# EAGLE design signal generator schematic - botttom (EAGLE 8.3.1)
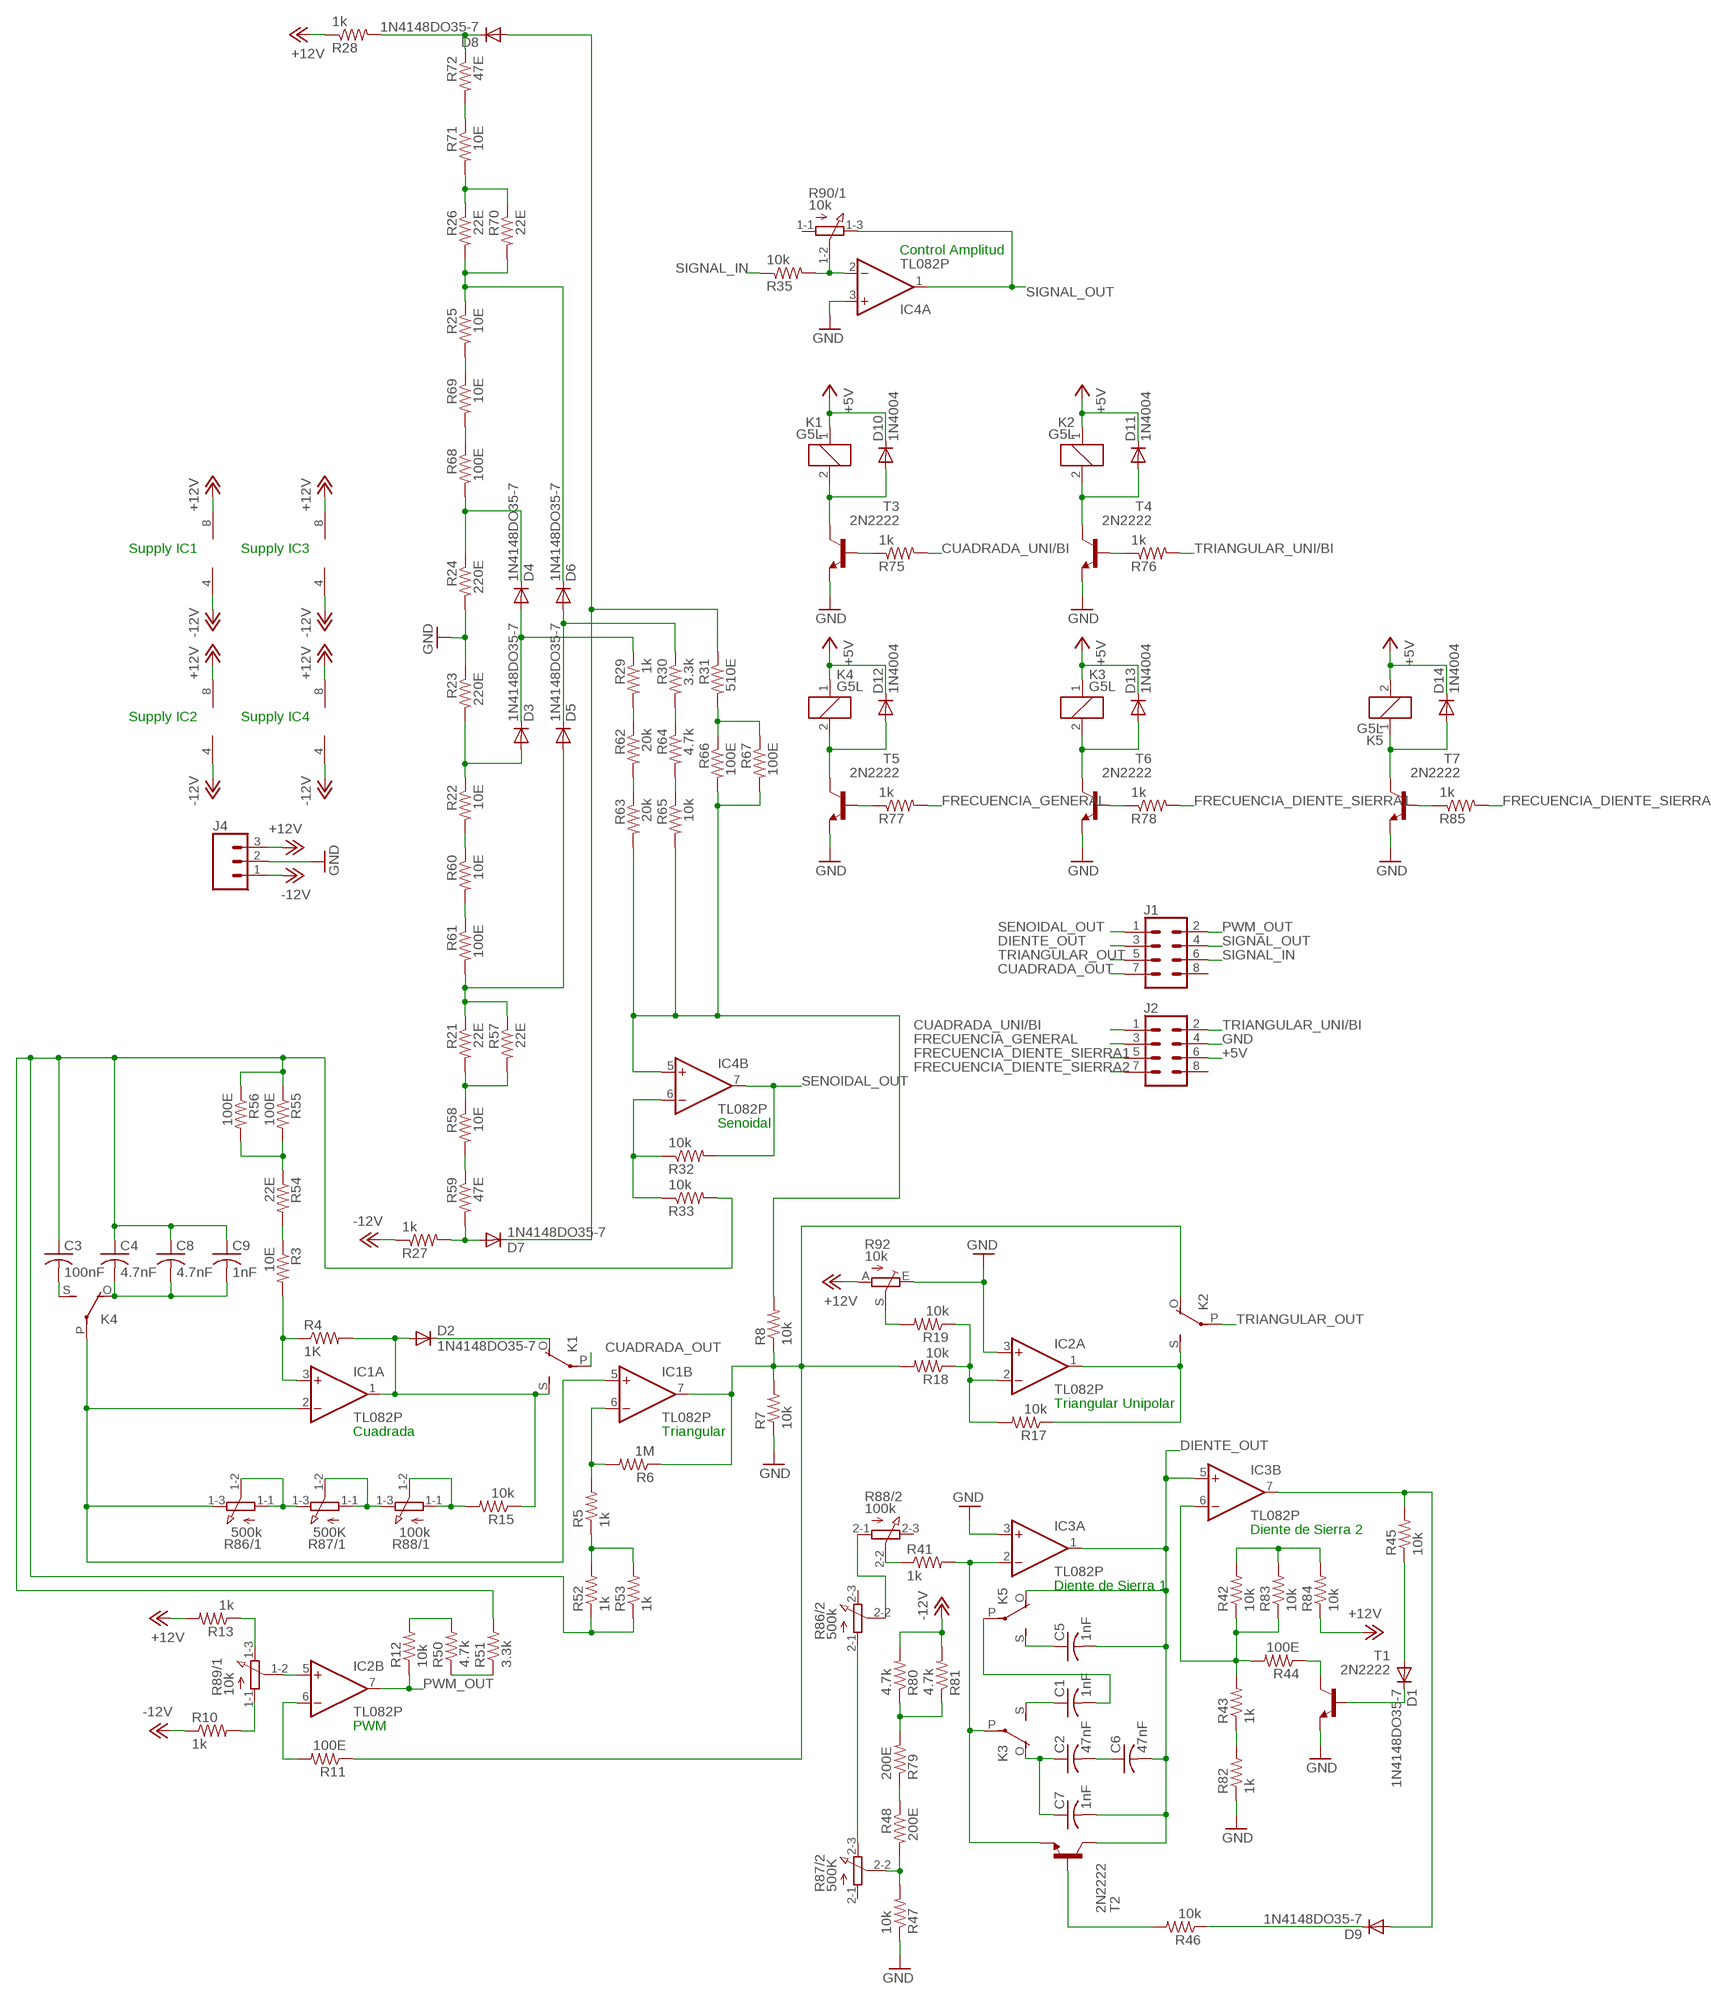
[diagram p0: schematic, sheet 1]

## Parts
C1  1nF  C-US150-054X183  [C150-054X183]
C2  47nF  C-US150-054X183  [C150-054X183]
C3  100nF  C-US150-084X183  [C150-084X183]
C4  4.7nF  C-US102-043X133  [C102-043X133]
C5  1nF  C-US150-054X183  [C150-054X183]
C6  47nF  C-US150-054X183  [C150-054X183]
C7  1nF  C-US150-054X183  [C150-054X183]
C8  4.7nF  C-US102-043X133  [C102-043X133]
C9  1nF  C-US150-054X183  [C150-054X183]
D1  1N4148DO35-7  [DO35-7]
D2  1N4148DO35-7  [DO35-7]
D3  1N4148DO35-7  [DO35-7]
D4  1N4148DO35-7  [DO35-7]
D5  1N4148DO35-7  [DO35-7]
D6  1N4148DO35-7  [DO35-7]
D7  1N4148DO35-7  [DO35-7]
D8  1N4148DO35-7  [DO35-7]
D9  1N4148DO35-7  [DO35-7]
D10  1N4004  [DO41-10]
D11  1N4004  [DO41-10]
D12  1N4004  [DO41-10]
D13  1N4004  [DO41-10]
D14  1N4004  [DO41-10]
IC1  TL082P  [DIL08]
IC2  TL082P  [DIL08]
IC3  TL082P  [DIL08]
IC4  TL082P  [DIL08]
J1  CONN_04X2  [2X4]
J2  CONN_04X2  [2X4]
J4  CONN_03-SCREW-5MM  [SCREWTERMINAL-5MM-3]
K1  G5L  [G5LE]
K2  G5L  [G5LE]
K3  G5L  [G5LE]
K4  G5L  [G5LE]
K5  G5L  [G5LE]
R3  10E  R-US_0207/7  [0207/7]
R4  1K  R-US_0207/7  [0207/7]
R5  1k  R-US_0207/7  [0207/7]
R6  1M  R-US_0207/7  [0207/7]
R7  10k  R-US_0207/7  [0207/7]
R8  10k  R-US_0207/7  [0207/7]
R10  1k  R-US_0207/7  [0207/7]
R11  100E  R-US_0207/7  [0207/7]
R12  10k  R-US_0207/7  [0207/7]
R13  1k  R-US_0207/7  [0207/7]
R15  10k  R-US_0207/7  [0207/7]
R17  10k  R-US_0207/7  [0207/7]
R18  10k  R-US_0207/7  [0207/7]
R19  10k  R-US_0207/7  [0207/7]
R21  22E  R-US_0207/7  [0207/7]
R22  10E  R-US_0207/7  [0207/7]
R23  220E  R-US_0207/7  [0207/7]
R24  220E  R-US_0207/7  [0207/7]
R25  10E  R-US_0207/7  [0207/7]
R26  22E  R-US_0207/7  [0207/7]
R27  1k  R-US_0207/7  [0207/7]
R28  1k  R-US_0207/7  [0207/7]
R29  1k  R-US_0207/7  [0207/7]
R30  3.3k  R-US_0207/7  [0207/7]
R31  510E  R-US_0207/7  [0207/7]
R32  10k  R-US_0207/7  [0207/7]
R33  10k  R-US_0207/7  [0207/7]
R35  10k  R-US_0207/7  [0207/7]
R41  1k  R-US_0207/7  [0207/7]
R42  10k  R-US_0207/7  [0207/7]
R43  1k  R-US_0207/7  [0207/7]
R44  100E  R-US_0207/7  [0207/7]
R45  10k  R-US_0207/7  [0207/7]
R46  10k  R-US_0207/7  [0207/7]
R47  10k  R-US_0207/7  [0207/7]
R48  200E  R-US_0207/7  [0207/7]
R50  4.7k  R-US_0207/7  [0207/7]
R51  3.3k  R-US_0207/7  [0207/7]
R52  1k  R-US_0207/7  [0207/7]
R53  1k  R-US_0207/7  [0207/7]
R54  22E  R-US_0207/7  [0207/7]
R55  100E  R-US_0207/7  [0207/7]
R56  100E  R-US_0207/7  [0207/7]
R57  22E  R-US_0207/7  [0207/7]
R58  10E  R-US_0207/7  [0207/7]
R59  47E  R-US_0207/7  [0207/7]
R60  10E  R-US_0207/7  [0207/7]
R61  100E  R-US_0207/7  [0207/7]
R62  20k  R-US_0207/7  [0207/7]
R63  20k  R-US_0207/7  [0207/7]
R64  4.7k  R-US_0207/7  [0207/7]
R65  10k  R-US_0207/7  [0207/7]
R66  100E  R-US_0207/7  [0207/7]
R67  100E  R-US_0207/7  [0207/7]
R68  100E  R-US_0207/7  [0207/7]
R69  10E  R-US_0207/7  [0207/7]
R70  22E  R-US_0207/7  [0207/7]
R71  10E  R-US_0207/7  [0207/7]
R72  47E  R-US_0207/7  [0207/7]
R75  1k  R-US_0207/7  [0207/7]
R76  1k  R-US_0207/7  [0207/7]
R77  1k  R-US_0207/7  [0207/7]
R78  1k  R-US_0207/7  [0207/7]
R79  200E  R-US_0207/7  [0207/7]
R80  4.7k  R-US_0207/7  [0207/7]
R81  4.7k  R-US_0207/7  [0207/7]
R82  1k  R-US_0207/7  [0207/7]
R83  10k  R-US_0207/7  [0207/7]
R84  10k  R-US_0207/7  [0207/7]
R85  1k  R-US_0207/7  [0207/7]
R86  500k  3RP/1610G  [3RP/1610G]
R87  500K  3RP/1610G  [3RP/1610G]
R88  100k  3RP/1610G  [3RP/1610G]
R89  10k  3RP/1610G  [3RP/1610G]
R90  10k  3RP/1610G  [3RP/1610G]
R92  10k  TRIM_EU-S63P  [S63P]
T1  2N2222  [TO92-EBC-OVAL]
T2  2N2222  [TO92-EBC-OVAL]
T3  2N2222  [TO92-EBC-OVAL]
T4  2N2222  [TO92-EBC-OVAL]
T5  2N2222  [TO92-EBC-OVAL]
T6  2N2222  [TO92-EBC-OVAL]
T7  2N2222  [TO92-EBC-OVAL]

## Nets
+5V: D10.C D11.C D12.C D13.C D14.C J2.6 K1.1 K2.1 K3.1 K4.1 K5.2
+12V: IC1.8(P:V+) IC2.8(P:V+) IC3.8(P:V+) IC4.8(P:V+) J4.3 R13.2 R28.1 R84.1 R92.A
-12V: IC1.4(P:V-) IC2.4(P:V-) IC3.4(P:V-) IC4.4(P:V-) J4.1 R10.1 R27.1 R80.2 R81.2
CUADRADA_OUT: J1.7 K1.P(2:P)
CUADRADA_UNI/BI: J2.1 R75.2
DIENTE_OUT: C5.2 C6.2 C7.2 IC3.1(A:OUT) IC3.5(B:+IN) J1.3 K5.O(2:O) T2.C
FRECUENCIA_DIENTE_SIERRA1: J2.5 R78.2
FRECUENCIA_DIENTE_SIERRA2: J2.7 R85.2
FRECUENCIA_GENERAL: J2.3 R77.2
GND: IC2.3(A:+IN) IC3.3(A:+IN) IC4.3(A:+IN) J2.4 J4.2 R7.1 R23.1 R24.2 R47.1 R82.1 R92.E T1.E T3.E T4.E T5.E T6.E T7.E
N$1: IC1.3(A:+IN) R3.2 R4.1
N$2: C1.2 K5.P(2:P)
N$3: R58.2 R59.1
N$4: R13.1 R89.1-3(/1:E)
N$5: IC1.6(B:-IN) R5.2 R6.2
N$6: R87.1-1(/1:A) R87.1-2(/1:S) R88.1-3(/1:E)
N$7: IC2.5(B:+IN) R89.1-2(/1:S)
N$8: R10.2 R89.1-1(/1:A)
N$9: IC2.6(B:-IN) R11.2
N$10: R19.2 R92.S
N$11: R15.2 R88.1-1(/1:A) R88.1-2(/1:S)
N$12: D5.C D6.A R30.1
N$13: D5.A R21.1 R57.1 R61.2
N$14: IC2.2(A:-IN) R17.2 R18.1 R19.1
N$15: D3.A R22.1 R23.2
N$16: D7.A R27.2 R59.2
N$17: D6.C R25.1 R26.2 R70.2
N$18: IC4.2(A:-IN) R35.2 R90.1-2(/1:S)
N$19: D3.C D4.A R29.1
N$20: D4.C R24.1 R68.2
N$21: D8.C R28.2 R72.1
N$22: D7.C D8.A R31.1
N$23: IC4.5(B:+IN) R8.2 R63.2 R65.2 R66.2 R67.2
N$25: R75.1 T3.B
N$26: IC1.2(A:-IN) IC1.5(B:+IN) K4.P(2:P) R86.1-3(/1:E)
N$27: R41.1 R88.2-2(/2:S)
N$28: C2.1 C7.1 K3.O(2:O)
N$29: IC4.6(B:-IN) R32.1 R33.1
N$30: C1.1 K3.S(2:S)
N$31: R47.2 R48.2 R87.2-2(/2:S)
N$32: R86.2-1(/2:A) R87.2-3(/2:E)
N$33: R46.2 T2.B
N$34: D1.C T1.B
N$35: IC3.6(B:-IN) R42.1 R43.2 R44.2 R83.1
N$36: R44.1 T1.C
N$37: D1.A R45.1
N$38: D9.A IC3.7(B:OUT) R45.2
N$39: D9.C R46.1
N$40: R12.2 R50.2
N$41: R50.1 R51.1
N$42: R5.1 R52.2 R53.2
N$43: C4.2 C8.2 C9.2 K4.O(2:O)
N$44: R3.1 R54.2
N$45: C3.2 K4.S(2:S)
N$46: R54.1 R55.2 R56.2
N$47: R21.2 R57.2 R58.1
N$48: C3.1 C4.1 C8.1 C9.1 R33.2 R51.2 R52.1 R53.1 R55.1 R56.1
N$49: R60.2 R61.1
N$50: R22.2 R60.1
N$51: R29.2 R62.1
N$52: R62.2 R63.1
N$53: R64.2 R65.1
N$54: R30.2 R64.1
N$55: R25.2 R69.1
N$56: R31.2 R66.1 R67.1
N$57: R68.1 R69.2
N$58: R71.1 R72.2
N$59: R26.1 R70.1 R71.2
N$60: D2.C K1.O(2:O)
N$61: D10.A K1.2 T3.C
N$62: R76.1 T4.B
N$63: D11.A K2.2 T4.C
N$64: R77.1 T5.B
N$65: D12.A K4.2 T5.C
N$66: R78.1 T6.B
N$67: D13.A K3.2 T6.C
N$68: IC3.2(A:-IN) K3.P(2:P) R41.2 T2.E
N$69: R48.1 R79.1
N$70: C5.1 K5.S(2:S)
N$71: R79.2 R80.1 R81.1
N$72: R43.1 R82.2
N$73: C2.2 C6.1
N$74: R42.2 R83.2 R84.2
N$75: R86.1-1(/1:A) R86.1-2(/1:S) R87.1-3(/1:E)
N$76: R85.1 T7.B
N$77: D14.A K5.1 T7.C
N$78: R86.2-2(/2:S) R88.2-1(/2:A)
N$90: D2.A IC1.1(A:OUT) K1.S(2:S) R4.2 R15.1
N$91: IC1.7(B:OUT) K2.O(2:O) R6.1 R7.2 R8.1 R11.1 R18.2
N$92: IC2.1(A:OUT) K2.S(2:S) R17.1
PWM_OUT: IC2.7(B:OUT) J1.2 R12.1
SENOIDAL_OUT: IC4.7(B:OUT) J1.1 R32.2
SIGNAL_IN: J1.6 R35.1
SIGNAL_OUT: IC4.1(A:OUT) J1.4 R90.1-3(/1:E)
TRIANGULAR_OUT: J1.5 K2.P(2:P)
TRIANGULAR_UNI/BI: J2.2 R76.2
Unconnected: J1.8 J2.8 R86.2-3(/2:E) R87.2-1(/2:A) R88.2-3(/2:E) R89.2-1(/2:A) R89.2-2(/2:S) R89.2-3(/2:E) R90.1-1(/1:A) R90.2-1(/2:A) R90.2-2(/2:S) R90.2-3(/2:E)

## Notes on the sheet
- Control Amplitud
- Supply IC1 | Supply IC3
- Supply IC2 | Supply IC4
- Senoidal
- Triangular Unipolar
- Cuadrada | Triangular
- Diente de Sierra 2
- Diente de Sierra 1
- PWM

## Library data of the parts
C1-C9 = adafruit:C-US: CAPACITOR, American symbol
D1-D9 = diode:1N4148: DIODE high speed (Philips)
D10-D14 = diode:1N4004: DIODE general purpose rectifier, 1 A
IC1-IC4 = linear:TL082: OP AMP Data sheet <http://www.ti.com/lit/ds/symlink/tl084a . pdf>; DATA_SHEET: <a href="http://www.ti.com/lit/ds/symlink/tl084a.pdf"> Data sheet </a>
J1 J2 = SparkFun-Connectors:CONN_04X2: Multi connection point. Often used as Generic Header-pin footprint for 0.1 inch spaced/style header connections On any of the 0.1 inch spaced packages, you can populate with these: Break Away Headers - Straight <https://www.sparkfun.com/products/116> (PRT-00116) Break Away Male Headers - Right Angle <https://www.sparkfun.com/products/553> (PRT-00553) Female Headers <https://www.sparkfun.com/products/115> (PRT-00115) Break Away Headers - Machine Pin <https://www.sparkfun.com/products/117> (PRT-00117) Break Away Female Headers - Swiss Machine Pin <https://www.sparkfun.com/products/743> (PRT-00743)
J4 = SparkFun-Connectors:CONN_03: Multi connection point. Often used as Generic Header-pin footprint for 0.1 inch spaced/style header connections On any of the 0.1 inch spaced packages, you can populate with these: Break Away Headers - Straight <https://www.sparkfun.com/products/116> (PRT-00116) Break Away Male Headers - Right Angle <https://www.sparkfun.com/products/553> (PRT-00553) Female Headers <https://www.sparkfun.com/products/115> (PRT-00115) Break Away Headers - Machine Pin <https://www.sparkfun.com/products/117> (PRT-00117) Break Away Female Headers - Swiss Machine Pin <https://www.sparkfun.com/products/743> (PRT-00743) Stackable Header - 3 Pin (Female, 0.1") <https://www.sparkfun.com/products/13875> (PRT-13875) For SCREWTERMINALS and SPRING TERMINALS visit here: Screw Terimnals on SparkFun.com <https://www.sparkfun.com/search/results?term=Screw+Terminals> (5mm/3.5mm/2.54mm spacing) This device is also useful as a general connection point to wire up your design to another part of your project. Our various solder wires solder well into these plated through hole pads. Hook-Up Wire - Assortment (Stranded, 22 AWG) <https://www.sparkfun.com/products/11375> (PRT-11375) Hook-Up Wire - Assortment (Solid Core, 22 AWG) <https://www.sparkfun.com/products/11367> (PRT-11367) View the entire wire category on our website here <https://www.sparkfun.com/categories/141> Special notes: Molex polarized connector foot print use with SKU : PRT-08232 with associated crimp pins and housings.; PROD_ID: CONN-10134; SF_SKU: PRT-08433
K1-K5 = relay:G5L: RELAY 1 x switch, 10 A/120 V AC, 8 A/30 V ADC, Omron; OC_FARNELL: unknown; OC_NEWARK: unknown
R3-R8 R10-R13 R15 R17-R19 R21-R33 R35 R41-R48 R50-R72 R75-R85 = adafruit:R-US_: RESISTOR, American symbol
R86-R90 = pot:3RP/1610G: 16mm Potentiometer two level Source: http://www.alphapotentiometers.net/html/16mm_pot_2.html
R92 = pot:TRIM_EU-: POTENTIOMETER
T1-T7 = adafruit:2N2222: NPN TRANSISTOR Big oval pads

## Board
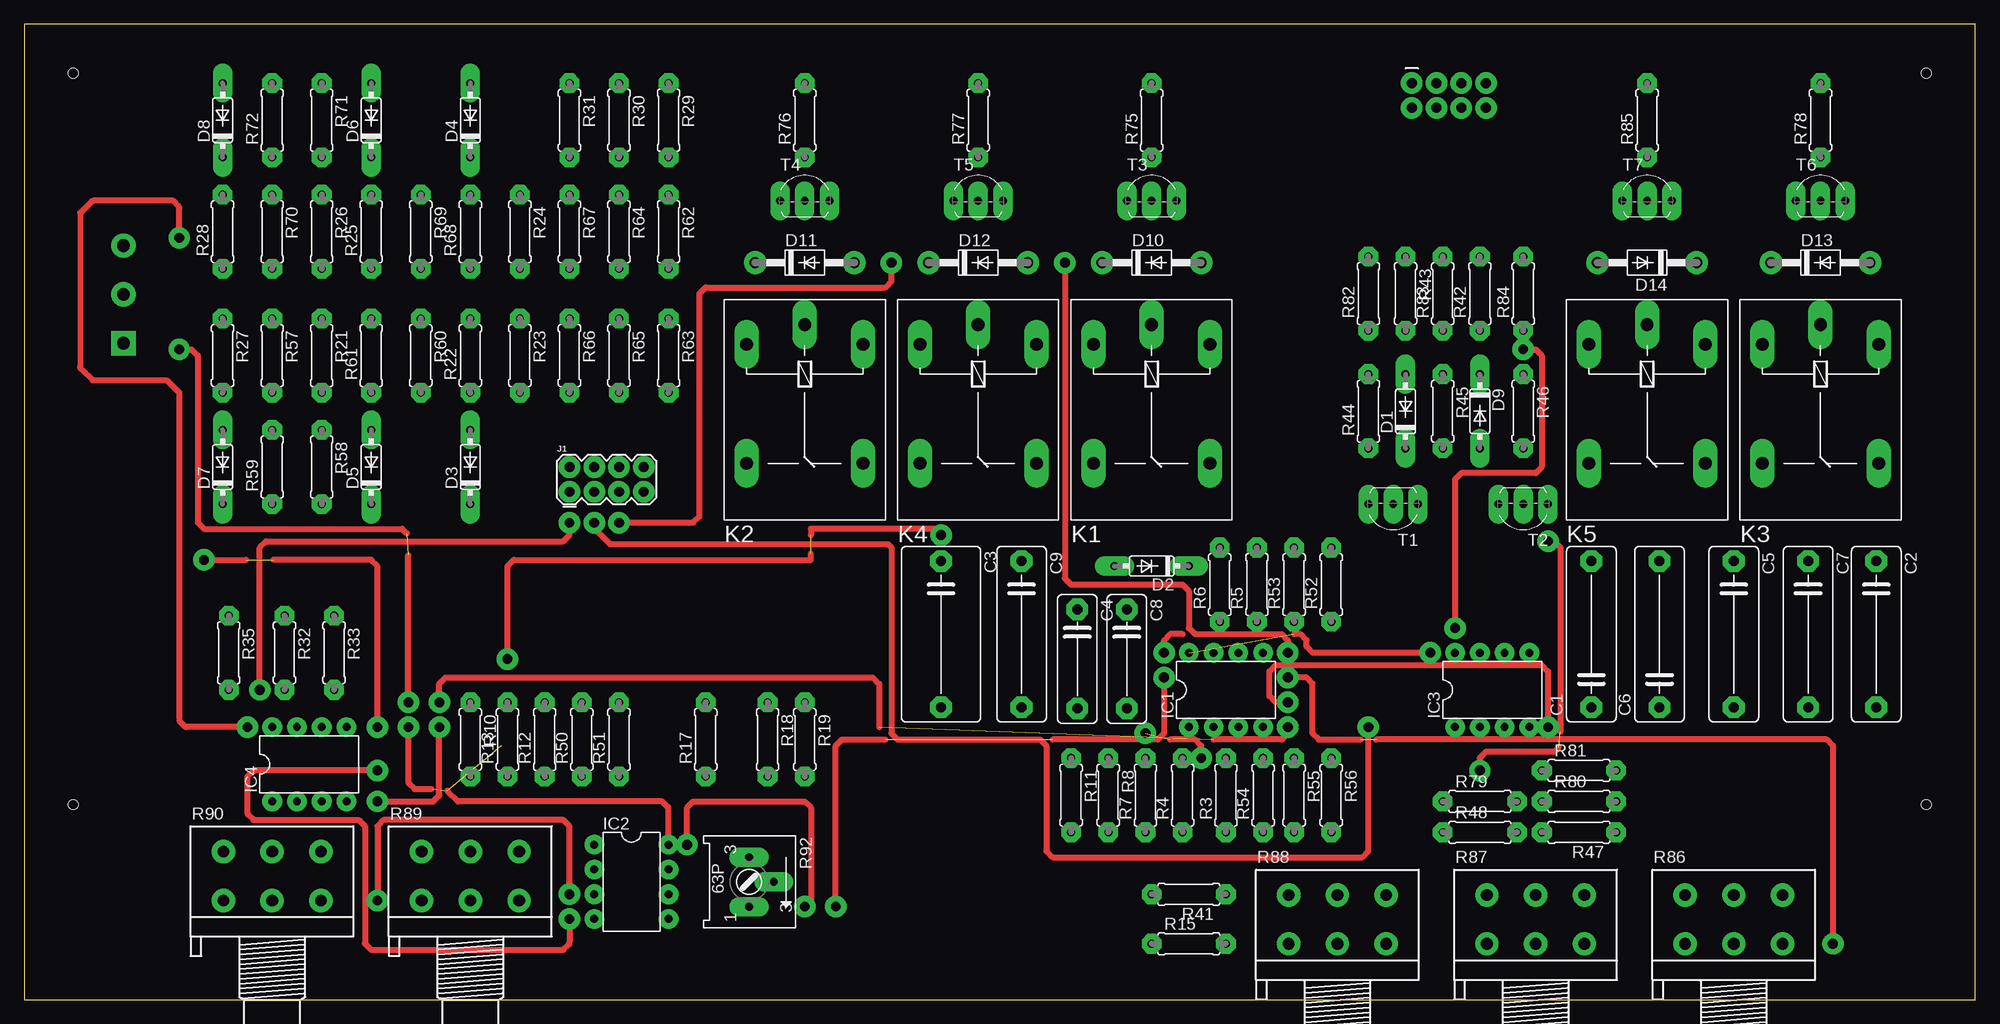
[diagram p1: board, top side]
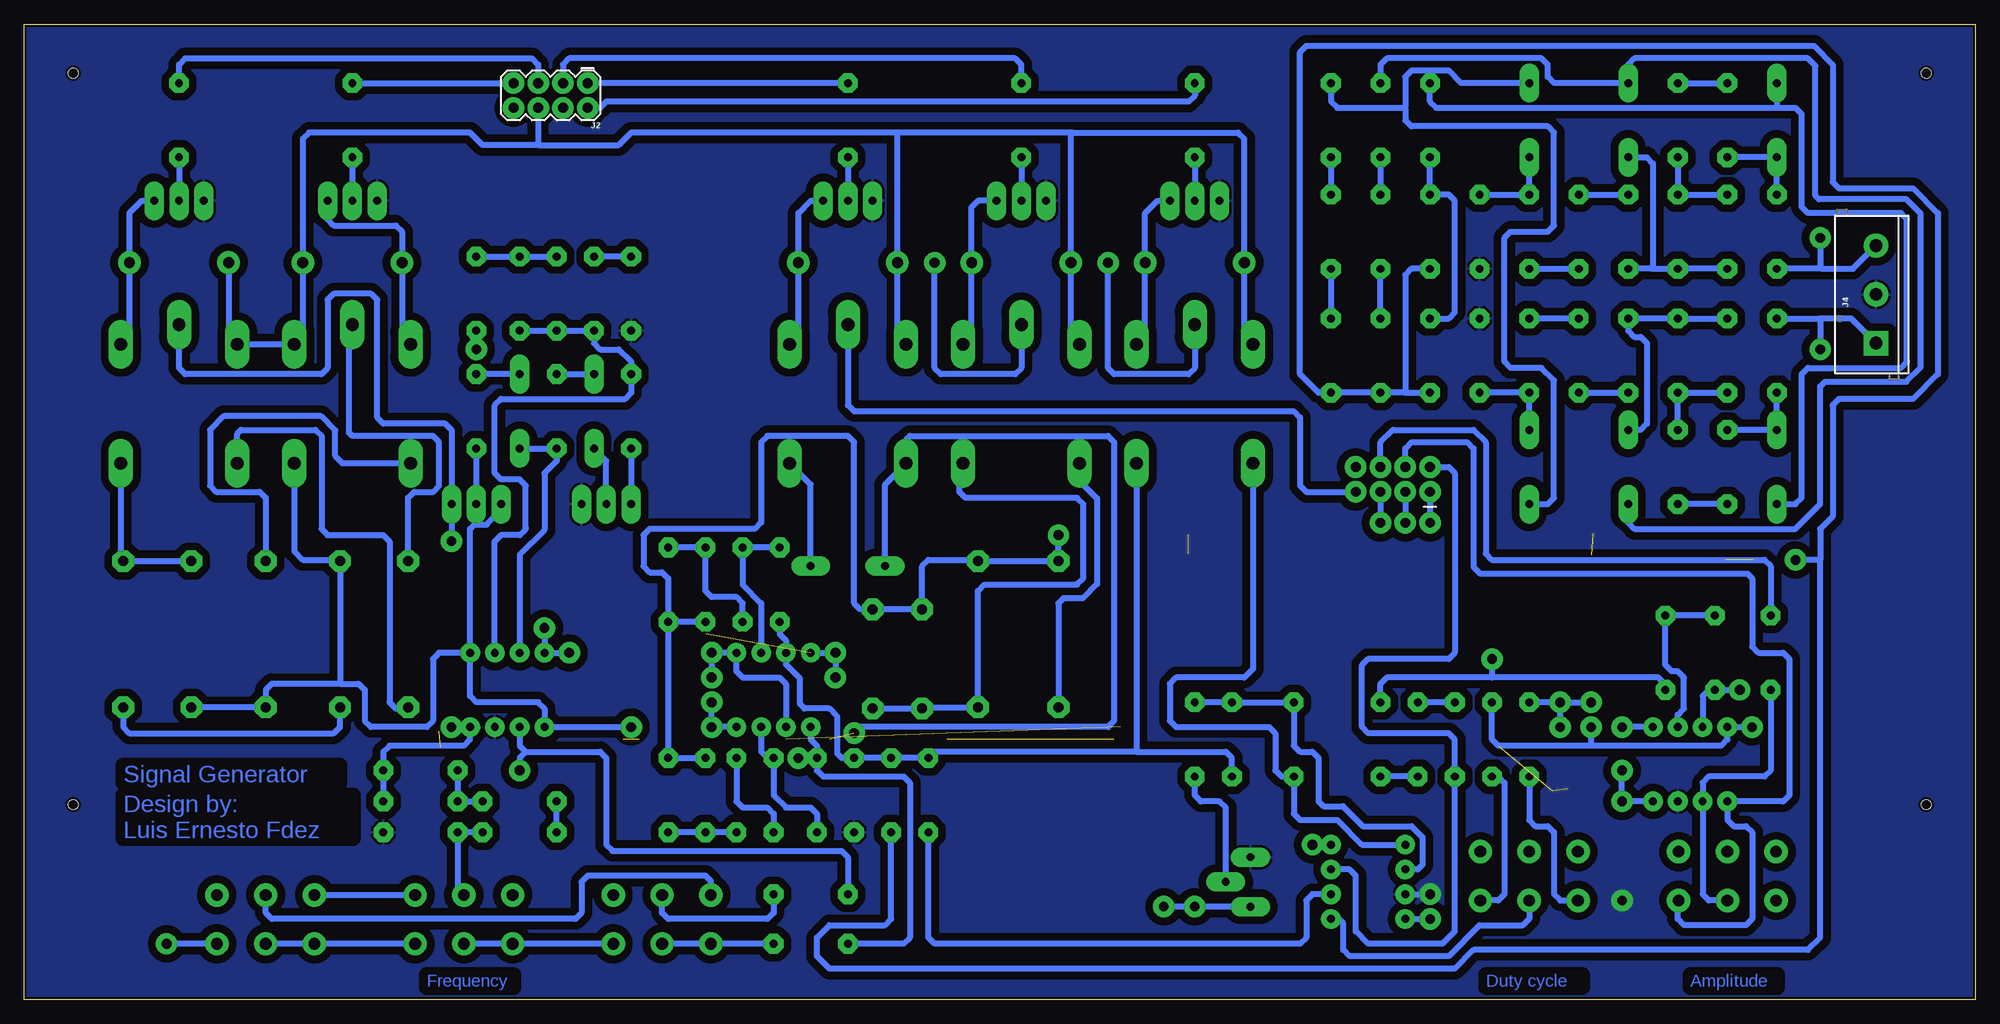
[diagram p2: board, bottom side, seen from below]

Size 200 x 100 mm. Coordinates in mm from the lower left corner, seen from the top.
Outline: 0,0 200,0 200,100 0,100 0,0
Copper layers (1*16): Top 0.035mm / dielectric 1.5mm / Bottom 0.035mm
Design rules "Maker Friendly Design Rules": minimum track width 0.8mm, minimum drill 0.8mm, track to track 0.8mm, track to pad 0.8mm, pad to pad 0.45mm, via to via 0.8mm, smd to smd 8mil, copper to edge 10mil, drill to drill 8mil, minimum pad ring 0.6mm, minimum via ring 0.6mm, stop-mask expansion 0mil, vias tented up to drill 0mil, thermal gap 10mil
Holes 1 mm at 5,20 195,20 195,95 5,95

### Footprints (pad centres in the part's own frame; a part is rotated, then mirrored left to right if it is on the bottom)
C150-054X183 = drill 1.016 octagon: 1 -7.493,0; 2 7.493,0
C150-084X183 = drill 1.016 octagon: 1 -7.493,0; 2 7.493,0
C102-043X133 = drill 1.016 octagon: 1 -5.08,0; 2 5.08,0
DO35-7 = drill 0.813 long: A 3.81,0; C -3.81,0
DO41-10 = drill 1.118: A 5.08,0; C -5.08,0
DIL08 = drill 0.813 pad 1.27: 1 -3.81,-3.81; 2 -1.27,-3.81; 3 1.27,-3.81; 4 3.81,-3.81; 5 3.81,3.81; 6 1.27,3.81; 7 -1.27,3.81; 8 -3.81,3.81
2X4 = drill 1.016 pad 1.88: 1 -3.81,-1.27; 2 -3.81,1.27; 3 -1.27,-1.27; 4 -1.27,1.27; 5 1.27,-1.27; 6 1.27,1.27; 7 3.81,-1.27; 8 3.81,1.27
SCREWTERMINAL-5MM-3 = drill 1.3 pad 2.413 square: 1 0,0 | drill 1.3 pad 2.413: 2 5,0; 3 10,0
G5LE = drill 1.321 long: 1 -7.493,-5.969; 2 -7.493,5.969; O 4.699,5.969; P -9.525,0; S 4.699,-5.969
0207/7 = drill 0.813 octagon: 1 -3.81,0; 2 3.81,0
3RP/1610G = drill 1.2 pad 2.184: 1-1 -5,0; 1-2 0,0; 1-3 5,0; 2-1 -5,5; 2-2 0,5; 2-3 5,5
S63P = drill 0.813 long: A 2.54,0; E -2.54,0; S 0,2.54
TO92-EBC-OVAL = drill 0.813 long: B 0,-1.27; C 2.54,-1.27; E -2.54,-1.27

### Placement (x,y rotation side)
C1  160.66,37.47 90 top
C2  189.87,37.47 270 top
C3  93.98,37.47 270 top
C4  107.95,34.92 270 top
C5  175.26,37.47 270 top
C6  167.64,37.47 90 top
C7  182.88,37.47 270 top
C8  113.03,34.92 270 top
C9  102.23,37.47 270 top
D1  141.6,60.33 90 top
D2  115.57,44.45 180 top
D3  45.72,54.61 90 top
D4  45.72,90.17 90 top
D5  35.56,54.61 90 top
D6  35.56,90.17 90 top
D7  20.32,54.61 90 top
D8  20.32,90.17 90 top
D9  149.22,60.33 270 top
D10  115.57,75.56 0 top
D11  80.01,75.56 0 top
D12  97.79,75.56 0 top
D13  184.15,75.56 0 top
D14  166.37,75.56 180 top
IC1  123.19,31.75 0 top
IC2  62.23,12.06 270 top
IC3  150.5,31.75 0 top
IC4  29.21,24.13 0 top
J1  59.69,53.34 0 top
J2  146.05,92.71 180 bottom
J4  10.16,67.31 90 bottom
K1  115.57,59.69 270 top
K2  80.01,59.69 270 top
K3  184.15,59.69 270 top
K4  97.79,59.69 270 top
K5  166.37,59.69 270 top
R3  123.19,20.95 90 top
R4  118.75,20.95 90 top
R5  126.36,42.55 90 top
R6  122.56,42.55 90 top
R7  114.94,20.95 90 top
R8  111.12,20.95 270 top
R10  45.72,26.67 270 top
R11  107.31,20.95 270 top
R12  53.34,26.67 90 top
R13  49.53,26.67 90 top
R15  119.38,5.71 0 top
R17  69.85,26.67 90 top
R18  76.2,26.67 270 top
R19  80.01,26.67 270 top
R21  30.48,66.04 270 top
R22  45.72,66.04 90 top
R23  50.8,66.04 270 top
R24  50.8,78.74 270 top
R25  35.56,78.74 90 top
R26  30.48,78.74 270 top
R27  20.32,66.04 270 top
R28  20.32,78.74 90 top
R29  66.04,90.17 270 top
R30  60.96,90.17 270 top
R31  55.88,90.17 270 top
R32  26.67,35.56 270 top
R33  31.75,35.56 270 top
R35  20.95,35.56 270 top
R41  119.38,10.79 180 top
R42  149.22,72.39 90 top
R43  141.6,72.39 270 top
R44  137.79,60.33 90 top
R45  145.41,60.33 270 top
R46  153.67,60.33 270 top
R47  159.38,17.14 180 top
R48  149.22,17.14 0 top
R50  57.15,26.67 90 top
R51  60.96,26.67 90 top
R52  133.99,42.55 90 top
R53  130.18,42.55 90 top
R54  127,20.95 90 top
R55  130.18,20.95 270 top
R56  133.99,20.95 270 top
R57  25.4,66.04 270 top
R58  30.48,54.61 270 top
R59  25.4,54.61 90 top
R60  40.64,66.04 270 top
R61  35.56,66.04 90 top
R62  66.04,78.74 270 top
R63  66.04,66.04 270 top
R64  60.96,78.74 270 top
R65  60.96,66.04 270 top
R66  55.88,66.04 270 top
R67  55.88,78.74 270 top
R68  45.72,78.74 90 top
R69  40.64,78.74 270 top
R70  25.4,78.74 270 top
R71  30.48,90.17 270 top
R72  25.4,90.17 90 top
R75  115.57,90.17 90 top
R76  80.01,90.17 90 top
R77  97.79,90.17 90 top
R78  184.15,90.17 90 top
R79  149.22,20.32 0 top
R80  159.38,20.32 0 top
R81  159.38,23.5 0 top
R82  137.79,72.39 90 top
R83  145.41,72.39 90 top
R84  153.67,72.39 90 top
R85  166.37,90.17 90 top
R86  175.26,5.71 0 top
R87  154.94,5.71 0 top
R88  134.62,5.71 0 top
R89  45.72,10.16 0 top
R90  25.4,10.16 0 top
R92  74.3,12.06 270 top
T1  140.34,49.53 180 top
T2  153.67,49.53 180 top
T3  115.57,83.19 0 top
T4  80.01,83.19 0 top
T5  97.79,83.19 0 top
T6  184.15,83.19 0 top
T7  166.37,83.19 0 top

### Tracks (layer width: path | path; a pad name or v marks a point on that pad's centre or on a via)
+5V
  Bottom 0.61: D13.C 179.07,68.07 K3.1 K5.2 171.45,68.07 D14.C 171.45,88.27 170.81,88.9 154.31,88.9 153.03,87.63 147.26,87.63 | K1.1 110.49,68.07 D10.C 110.49,88.85 110.54,88.9 | K4.1 92.71,68.07 D12.C 92.71,88.75 92.56,88.9 | K2.1 74.93,68.07 D11.C 74.93,88.27 75.56,88.9 92.56,88.9 | 92.56,88.9 110.54,88.9 | 110.54,88.9 137.79,88.9 139.06,87.63 147.26,87.63 | J2.6 147.32,87.69 147.26,87.63
+12V  (via drill 1 pad 1.3)  (4 unrouted)
  Top 0.61: v22.86,27.94 16.64,27.94 arc-45 16.42,28.03 15.88,28.57 15.88,62.23 14.7,63.41 arc45 14.47,63.5 6.99,63.5 5.81,64.68 arc-45 5.71,64.9 5.71,80.64 6.89,81.82 arc-45 7.12,81.92 15.24,81.92 15.78,81.37 arc-45 15.88,81.15 v15.88,78.11 | IC2.8 66.04,19.55 arc45 65.95,19.78 65.41,20.32 44.45,20.32 43.36,21.41 | v39.37,27.94 39.37,22.36 arc45 39.46,22.13 40.01,21.59 41.73,21.59 | v153.67,66.67 154.94,66.67 155.57,66.04 155.57,54.61 154.94,53.98 147.32,53.98 146.69,53.34 v146.69,38.1 | v144.15,35.56 132.08,35.56 131.44,36.2 131.44,36.83 130.81,37.47 130.18,37.47 | v116.84,35.56 116.84,36.83 117.47,37.47 118.75,37.47 | v116.84,33.02 116.84,27.3 116.2,26.67 105.41,26.67 | v67.94,15.88 67.94,19.68 68.58,20.32 80.01,20.32 80.64,19.68 80.64,10.16 v80.01,9.53 | v83.19,9.53 83.19,26.04 83.82,26.67 88.27,26.67
  Bottom 0.61: 15.71,74.93 R28.1 | 15.71,74.93 12.54,74.93 J4.3 | R13.2 49.53,26.67 48.9,26.04 26.04,26.04 25.4,26.67 IC4.8 v22.86,27.94 | v15.88,78.11 15.88,75.23 arc-45 15.78,75 15.71,74.93 | 39.37,26.04 v39.37,27.94 | IC1.8 v116.84,35.56 v116.84,33.02 | R84.1 v153.67,66.67 | v146.69,38.1 IC3.8 v144.15,35.56 | IC2.8 v67.94,15.88 | R92.A v80.01,9.53 v83.19,9.53
-12V  (via drill 1 pad 1.3)  (2 unrouted)
  Top 0.61: v36.2,20.32 41.91,20.32 42.55,20.95 v42.55,27.94 | v55.88,8.26 55.88,5.85 arc-45 55.79,5.62 55.24,5.08 35.56,5.08 35.02,5.62 arc-45 34.92,5.85 34.92,17.78 34.38,18.32 arc45 34.16,18.41 23.5,18.41 22.95,18.96 arc-45 22.86,19.18 22.86,22.86 23.4,23.4 arc-45 23.63,23.5 v36.2,23.5 | v39.37,30.48 39.37,45.58 | v129.54,30.48 128.27,30.48 127.64,31.11 127.64,33.66 128.27,34.29 155.57,34.29 156.21,33.66 v156.21,27.94 | v42.55,30.48 42.55,32.38 43.18,33.02 87,33.02 87.63,32.38 87.63,27.94 | v129.54,27.94 129.54,27.3 128.91,26.67 121.92,26.67 | v15.88,66.67 17.14,66.67 17.78,66.04 17.78,48.9 18.41,48.26 38.73,48.26 39.19,47.8
  Bottom 0.61: R80.2 R81.2 163.19,25.4 162.56,26.04 154.94,26.04 154.31,26.67 IC3.4 v156.21,27.94 | IC4.4 v36.2,20.32 v36.2,23.5 | IC2.4 v55.88,8.26 | v42.55,30.48 R10.1 | v42.55,30.48 v39.37,30.48 | IC1.4 v129.54,27.94 v129.54,30.48 | v42.55,27.94 v42.55,30.48 | J4.1 12.7,69.85 15.88,69.85 | 15.88,69.85 v15.88,66.67 | R27.1 15.88,69.85
CUADRADA_OUT
  Bottom 0.61: K1.P 115.57,60.96 114.94,60.33 69.85,60.33 69.22,59.69 69.22,52.7 68.58,52.07 J1.7
CUADRADA_UNI/BI
  Bottom 0.61: R75.2 J2.1
DIENTE_OUT  (via drill 1 pad 1.3)
  Top 0.61: v58.42,48.9 58.76,48.56 58.76,47.98 60.05,46.69 88.56,46.69 88.9,46.35 88.9,27.3 89.53,26.67 104.14,26.67 104.78,26.04 104.78,15.24 105.41,14.61 137.16,14.61 137.79,15.24 v137.79,27.94
  Bottom 0.61: C7.2 C5.2 175.26,31.75 174.62,32.38 167.63,32.38 | K5.O 172.34,45.97 171.45,45.09 167.77,45.09 C6.2 167.64,32.39 167.63,32.38 | IC3.5 154.31,31.11 153.67,30.48 147.32,30.48 146.69,29.84 IC3.1 v137.79,27.94 | IC3.5 157.48,35.56 158.12,34.92 158.12,28.57 158.75,27.94 164.47,27.94 165.1,28.57 165.1,31.75 165.74,32.38 167.63,32.38 | IC3.5 154.31,48.26 153.88,48.69 152.61,48.69 151.13,50.16 T2.C | J1.3 v58.42,48.9
FRECUENCIA_DIENTE_SIERRA1
  Bottom 0.61: R78.2 184.15,95.89 183.51,96.52 147.96,96.52 147.32,95.89 J2.5
FRECUENCIA_DIENTE_SIERRA2
  Bottom 0.61: R85.2 J2.7
FRECUENCIA_GENERAL
  Bottom 0.61: R77.2 97.79,95.89 98.42,96.52 144.15,96.52 144.78,95.89 J2.3
GND  (via drill 1 pad 1.3)
  Top 0.61: v55.88,10.79 55.88,17.78 55.24,18.41 36.83,18.41 36.2,17.78 v36.2,10.16
  Bottom 0.61: IC2.3 v55.88,10.79
  pour Bottom: 200.66,-0.64 200.66,100.97 -0.64,100.97 -0.64,-0.64
N$1
  Bottom 0.61: R4.1 118.75,19.05 119.38,19.68 121.92,19.68 123.19,20.95 R3.2 123.83,24.77 124.46,25.4 IC1.3
N$2
  Bottom 0.61: C1.2 160.66,51.44 160.02,52.07 158.12,52.07 157.48,52.7 157.48,57.15 158.12,57.78 166.37,57.78 166.73,58.14 166.73,68.86 K5.P
N$3
  Bottom 0.61: R59.1 R58.2
N$4
  Bottom 0.61: R13.1 48.9,22.86 48.26,22.23 48.26,10.79 48.9,10.16 R89.1-3
N$5
  Bottom 0.61: R6.2 R5.2 126.36,42.55 124.46,40.64 IC1.6
N$6
  Bottom 0.61: R87.1-2 R87.1-1 R88.1-3
N$7
  Bottom 0.61: R89.1-2 45.72,8.26 46.35,7.62 50.8,7.62 53.98,4.45 64.14,4.45 64.77,5.08 64.77,7.81 65.21,8.26 IC2.5
N$8
  Bottom 0.61: R10.2 45.72,18.41 45.09,17.78 43.81,17.78 43.18,17.14 43.18,10.79 42.55,10.16 R89.1-1
N$9
  Bottom 0.61: IC2.6 67.94,10.79 68.58,10.16 68.58,6.35 69.22,5.71 106.68,5.71 107.31,6.35 R11.2
N$10
  Bottom 0.61: R92.S 76.83,19.68 77.47,20.32 79.38,20.32 80.01,20.95 R19.2
N$11
  Bottom 0.61: R88.1-2 R88.1-1 R15.2
N$12
  Bottom 0.61: R30.1 60.96,95.89 60.33,96.52 44.45,96.52 43.81,95.89 43.81,94.61 43.18,93.98 D6.A 35.56,95.89 34.92,96.52 17.14,96.52 16.37,95.75 16.37,82.41 16.02,82.06 7.04,82.06 5.58,80.59 5.58,64.82 7.04,63.36 15.38,63.36 15.88,62.87 15.88,50.8 18.41,48.26 34.92,48.26 35.56,48.9 D5.C
N$13
  Bottom 0.61: R57.1 R21.1 R61.2 35.56,68.58 34.92,67.94 34.29,67.94 33.66,67.31 33.66,59.05 34.29,58.42 D5.A
N$14
  Bottom 0.61: R19.1 R18.1 R17.2 69.85,26.04 69.22,25.4 67.94,25.4 67.31,24.77 67.31,20.32 66.81,19.82 64.77,19.82 64.77,19.77 62.78,17.78 57.78,17.78 56.66,16.65 56.66,13.83 57.15,13.34 IC2.2
N$15
  Bottom 0.61: 45.96,62.23 R22.1 | 45.96,62.23 R23.2 | D3.A 45.72,61.99 45.96,62.23
N$16
  Bottom 0.61: R27.2 D7.A R59.2
N$17
  Bottom 0.61: 33.13,74.93 R26.2 R70.2 | 33.13,74.93 R25.1 | D6.C 33.66,86.36 33.02,85.72 33.02,75.04 33.13,74.93
N$18
  Bottom 0.61: R90.1-2 27.3,10.16 27.94,10.79 IC4.2 27.94,22.23 27.3,22.86 21.59,22.86 20.95,23.5 R35.2
N$19
  Bottom 0.61: R29.1 66.04,92.08 65.41,91.44 58.52,91.44 | D4.A 52.7,93.98 53.98,95.25 57.78,95.25 58.42,94.61 58.42,91.54 58.52,91.44 | D3.C 43.81,50.8 43.18,51.44 43.18,63.5 44.45,64.77 47.62,64.77 48.26,65.41 48.26,78.11 47.62,78.74 43.81,78.74 43.18,79.38 43.18,88.9 43.81,89.53 57.78,89.53 58.42,90.17 58.42,91.34 58.52,91.44
N$20
  Bottom 0.61: D4.C R68.2 R24.1
N$21
  Bottom 0.61: 20.4,86.36 R72.1 | 20.4,86.36 D8.C | R28.2 20.32,86.28 20.4,86.36
N$22
  Bottom 0.61: 20.32,91.44 55.24,91.44 55.88,92.08 R31.1 | D8.A 20.32,91.44 | 20.32,91.44 18.41,91.44 17.78,90.81 17.78,81.28 17.14,80.64 7.62,80.64 6.99,80.01 6.99,65.41 7.62,64.77 17.14,64.77 17.78,64.14 17.78,51.44 18.41,50.8 D7.C
N$23  (via drill 1 pad 1.3)  (1 unrouted)
  Top 0.61: v36.2,27.94 36.2,44.45 35.56,45.09 25.54,45.09 | v18.41,45.09 22.72,45.09
  Bottom 0.61: R67.2 57.78,74.93 58.42,74.3 58.42,62.23 | 58.42,62.23 R66.2 | 58.42,62.23 R65.2 R63.2 67.31,62.23 69.22,64.14 69.22,97.16 68.58,97.79 16.51,97.79 14.61,95.89 14.61,83.82 13.97,83.19 6.35,83.19 3.81,80.64 3.81,64.14 6.35,61.59 13.97,61.59 14.61,60.96 14.61,49.53 15.88,48.26 15.88,45.09 | R8.2 111.12,8.26 111.76,7.62 117.47,7.62 118.75,6.35 118.75,4.45 117.47,3.17 53.34,3.17 51.44,5.08 17.14,5.08 15.88,6.35 15.88,45.09 | IC4.5 v36.2,27.94 | 15.88,45.09 v18.41,45.09
N$25
  Bottom 0.61: R75.1 T3.B
N$26  (via drill 1 pad 1.3)  (1 unrouted)
  Top 0.61: v106.68,75.56 106.68,43.18 107.31,42.55 118.75,42.55 119.38,41.91 119.38,38.1 120.02,37.47 128.91,37.47 129.54,36.83 v129.54,35.56 | v185.42,5.71 185.42,26.04 184.78,26.67 138.61,26.67 | v129.54,33.02 131.44,33.02 132.08,32.38 132.08,27.3 132.72,26.67 136.98,26.67
  Bottom 0.61: IC1.2 121.92,32.38 122.56,33.02 126.36,33.02 127,33.66 IC1.5 v129.54,35.56 v129.54,33.02 | K4.P 97.79,64.77 98.42,64.14 106.05,64.14 106.68,64.77 v106.68,75.56 | R86.1-3 v185.42,5.71
N$27
  Bottom 0.61: R41.1 123.19,8.89 123.83,8.26 133.99,8.26 134.62,8.89 R88.2-2
N$28
  Bottom 0.61: C7.1 C2.1 190.12,45.21 K3.O
N$29
  Bottom 0.61: R32.1 R33.1 31.75,34.29 31.11,33.66 30.48,33.66 29.84,33.02 29.84,29.84 30.48,29.21 IC4.6
N$30
  Bottom 0.61: K3.S 178.18,58.04 177.8,58.42 170.18,58.42 169.54,57.78 169.54,48.26 168.91,47.62 163.19,47.62 162.56,46.99 162.56,30.48 161.93,29.84 160.78,29.84 C1.1
N$31
  Bottom 0.61: R48.2 R47.2 155.57,11.35 R87.2-2
N$32
  Bottom 0.61: R86.2-1 R87.2-3
N$33
  Bottom 0.61: R46.2 T2.B
N$34
  Bottom 0.61: T1.B 140.34,55.24 D1.C
N$35
  Bottom 0.61: R42.1 R83.1 R43.2 141.6,67.31 140.97,66.67 139.06,66.67 137.79,65.41 R44.2 137.79,62.23 138.43,61.59 151.13,61.59 151.76,60.96 151.76,53.98 151.13,53.34 149.22,53.34 148.59,52.7 148.59,48.39 arc45 148.68,48.17 149.22,47.62 151.13,47.62 151.76,46.99 IC3.6
N$36
  Bottom 0.61: R44.1 T1.C
N$37
  Bottom 0.61: R45.1 D1.A
N$38
  Bottom 0.61: D9.A R45.2 145.41,55.24 146.69,53.98 146.69,48.17 149.22,45.63 IC3.7
N$39
  Bottom 0.61: D9.C R46.1
N$40
  Bottom 0.61: R12.2 R50.2
N$41
  Bottom 0.61: R50.1 R51.1
N$42
  Bottom 0.61: R52.2 R53.2 130.18,41.91 129.54,41.27 127,41.27 126.36,40.64 R5.1
N$43
  Bottom 0.61: C8.2 C4.2 107.82,29.97 C9.2 102.23,41.91 101.6,42.55 92.08,42.55 91.44,43.18 91.44,50.8 92.08,51.44 103.5,51.44 104.14,52.07 104.14,54.61 K4.O
N$44
  Bottom 0.61: R54.2 127,20.32 126.36,19.68 123.83,19.68 123.19,19.05 R3.1
N$45
  Bottom 0.61: K4.S 91.82,53.17 90.03,51.38 90.03,42.6 91.49,41.13 93.48,41.13 93.98,40.64 C3.2
N$46
  Bottom 0.61: R56.2 R55.2 R54.1
N$47
  Bottom 0.61: R57.2 R21.2 R58.1
N$48  (via drill 1 pad 1.3)  (1 unrouted)
  Top 0.61: v93.98,47.62 93.34,48.26 80.64,48.26 80.64,47.62 | v49.53,34.92 49.53,44.45 50.16,45.09 80.64,45.09 80.64,45.72
  Bottom 0.61: R53.1 R52.1 | R55.1 R56.1 R52.1 | R51.2 60.96,32.38 60.33,33.02 49.53,33.02 | R33.2 31.79,31.79 31.79,32.34 32.47,33.02 49.53,33.02 | R52.1 133.99,43.18 134.62,43.81 135.89,43.81 136.53,44.45 136.53,47.62 135.89,48.26 125.09,48.26 124.46,48.9 124.46,57.15 123.83,57.78 115.57,57.78 114.94,57.15 114.94,40.64 114.3,40.01 C8.1 C4.1 107.95,44.45 107.31,45.09 102.36,45.09 C9.1 C3.1 v93.98,47.62 | v49.53,34.92 49.53,33.02
N$49
  Bottom 0.61: R60.2 R61.1
N$50
  Bottom 0.61: R60.1 R22.2
N$51
  Bottom 0.61: R29.2 R62.1
N$52
  Bottom 0.61: R62.2 R63.1
N$53
  Bottom 0.61: R65.1 R64.2
N$54
  Bottom 0.61: R30.2 R64.1
N$55
  Bottom 0.61: R69.1 R25.2
N$56
  Bottom 0.61: 55.88,82.61 R31.2 | 55.88,82.61 R67.1 | R66.1 53.98,69.85 53.34,70.48 53.34,81.92 53.98,82.55 55.82,82.55 55.88,82.61
N$57
  Bottom 0.61: R68.1 R69.2
N$58
  Bottom 0.61: R71.1 R72.2
N$59
  Bottom 0.61: R70.1 R26.1 R71.2
N$60
  Bottom 0.61: D2.C 119.38,52.83 K1.O
N$61
  Bottom 0.61: K1.2 120.65,68.07 D10.A 120.65,80.64 119.38,81.92 T3.C
N$62
  Bottom 0.61: R76.1 T4.B
N$63
  Bottom 0.61: K2.2 85.09,68.07 D11.A 85.09,80.64 83.82,81.92 T4.C
N$64
  Bottom 0.61: R77.1 T5.B
N$65
  Bottom 0.61: K4.2 102.87,68.07 D12.A 102.87,81.28 102.23,81.92 T5.C
N$66
  Bottom 0.61: R78.1 T6.B
N$67
  Bottom 0.61: T6.C 187.96,81.92 189.23,80.64 D13.A 189.23,68.07 K3.2
N$68  (via drill 1 pad 1.3)  (1 unrouted)
  Top 0.61: 157.3,25.86 156.84,25.4 156.37,25.4 156.37,25.41 149.87,25.41 149.22,24.77 v149.22,23.5 | v156.21,46.99 156.84,46.99 157.48,46.35 157.48,27.48
  Bottom 0.61: R41.2 115.57,14.61 116.2,15.24 139.7,15.24 140.34,15.88 140.34,24.77 140.97,25.4 148.59,25.4 | K3.P 184.15,64.77 183.51,64.14 169.54,64.14 168.91,64.77 168.91,71.75 168.28,72.39 164.47,72.39 163.83,71.75 163.83,59.69 163.19,59.05 156.84,59.05 156.21,58.42 T2.E v156.21,46.99 | 148.59,25.4 149.22,26.04 IC3.2 | 148.59,25.4 149.22,24.77 v149.22,23.5
N$69
  Bottom 0.61: R48.1 R79.1
N$70
  Bottom 0.61: K5.S 167.39,54.99 168.13,55.74 168.13,58.37 169.6,59.83 179.56,59.83 180.97,58.42 180.97,52.7 180.34,52.07 175.9,52.07 175.26,51.44 C5.1
N$71
  Bottom 0.61: R79.2 R80.1 R81.1
N$72
  Bottom 0.61: R82.2 R43.1
N$73
  Bottom 0.61: 189.87,29.21 C2.2 189.87,27.94 189.23,27.3 168.28,27.3 167.64,27.94 C6.1
N$74
  Bottom 0.61: R83.2 R42.2 R84.2
N$75
  Bottom 0.61: R86.1-2 R86.1-1 R87.1-3
N$76
  Bottom 0.61: R85.1 T7.B
N$77
  Bottom 0.61: K5.1 161.29,68.07 D14.A 161.29,78.74 161.93,79.38 168.28,79.38 168.91,80.01 T7.C
N$78
  Bottom 0.61: R88.2-1 129.62,12.14 130.18,12.7 142.24,12.7 142.88,12.06 142.88,8.89 143.51,8.26 174.62,8.26 175.26,8.89 R86.2-2
N$90  (via drill 1 pad 1.3)  (1 unrouted)
  Top 0.61: v120.65,24.77 120.65,26.04 120.02,26.67 117.47,26.67
  Bottom 0.61: D2.A 111.76,52.83 K1.S 109.6,57.4 109.22,57.78 88.9,57.78 88.27,57.15 88.27,28.57 88.9,27.94 114.3,27.94 v114.94,27.3 | IC1.1 119.38,26.67 118.75,26.04 R4.2 | R4.2 118.75,23.5 118.11,22.86 109.86,22.86 109.22,22.23 109.22,6.35 109.86,5.71 R15.1 | R4.2 v120.65,24.77
N$91
  Bottom 0.61: R7.2 R8.1 R11.1 106.68,25.4 86,25.4 | R6.1 122.56,37.47 121.92,36.83 IC1.7 121.92,34.38 120.51,32.97 120.51,30.34 120.02,29.84 117.47,29.84 116.63,29 116.63,25.19 116.2,24.77 R7.2 | R18.2 76.2,24.77 76.83,25.4 86,25.4 | R7.2 115.57,24.77 | K2.O 85.98,25.42 86,25.4
N$92
  Bottom 0.61: IC2.1 62.87,15.88 65.41,18.41 69.22,18.41 69.85,19.05 R17.1 71.12,22.86 71.75,23.5 71.75,27.3 72.39,27.94 81.92,27.94 82.55,28.57 82.55,32.38 81.92,33.02 74.93,33.02 74.04,33.91 K2.S
PWM_OUT
  Bottom 0.61: IC2.7 64.14,13.34 63.5,12.7 63.5,6.99 62.23,5.71 54.61,5.71 53.34,6.99 R12.1 53.34,26.67 53.98,27.3 62.23,27.3 62.87,27.94 62.87,34.29 62.23,34.92 53.98,34.92 53.34,35.56 53.34,53.98 53.98,54.61 J1.2
SENOIDAL_OUT  (via drill 1 pad 1.3)
  Top 0.61: v24.13,31.75 24.13,46.35 24.77,46.99 55.24,46.99 55.88,47.62 v55.88,48.9
  Bottom 0.61: IC4.7 27.94,31.11 27.3,31.75 R32.2 v24.13,31.75 | J1.1 v55.88,48.9
SIGNAL_IN
  Bottom 0.61: J1.6 60.96,57.15 59.69,58.42 51.44,58.42 50.16,57.15 50.16,45.72 49.53,45.09 21.59,45.09 20.95,44.45 R35.1
SIGNAL_OUT
  Bottom 0.61: R90.1-3 30.48,10.08 30.48,8.26 29.84,7.62 23.5,7.62 22.86,8.26 22.86,17.14 23.5,17.78 24.77,17.78 25.4,18.41 IC4.1 19.68,20.32 19.05,20.95 19.05,34.92 19.68,35.56 22.23,35.56 22.86,36.2 22.86,43.18 23.36,43.67 50.75,43.67 51.44,44.36 51.44,56.52 52.07,57.15 57.78,57.15 58.42,56.52 J1.4
TRIANGULAR_OUT  (via drill 1 pad 1.3)
  Top 0.61: v60.96,48.9 68.58,48.9 69.22,49.53 69.22,72.39 69.85,73.03 88.27,73.03 88.9,73.66 v88.9,75.56
  Bottom 0.61: K2.P 80.01,64.77 80.64,64.14 88.27,64.14 88.9,64.77 v88.9,75.56 | J1.5 v60.96,48.9
TRIANGULAR_UNI/BI
  Bottom 0.61: J2.2 140.97,91.44 140.34,92.08 80.64,92.08 80.01,92.71 R76.2

### Text on the board
Bottom: Signal Generator | Design by: / Luis Ernesto Fdez | Amplitude | Duty cycle | Frequency